# EAGLE schematic ptn_eagle7x (EAGLE 7.7.0)
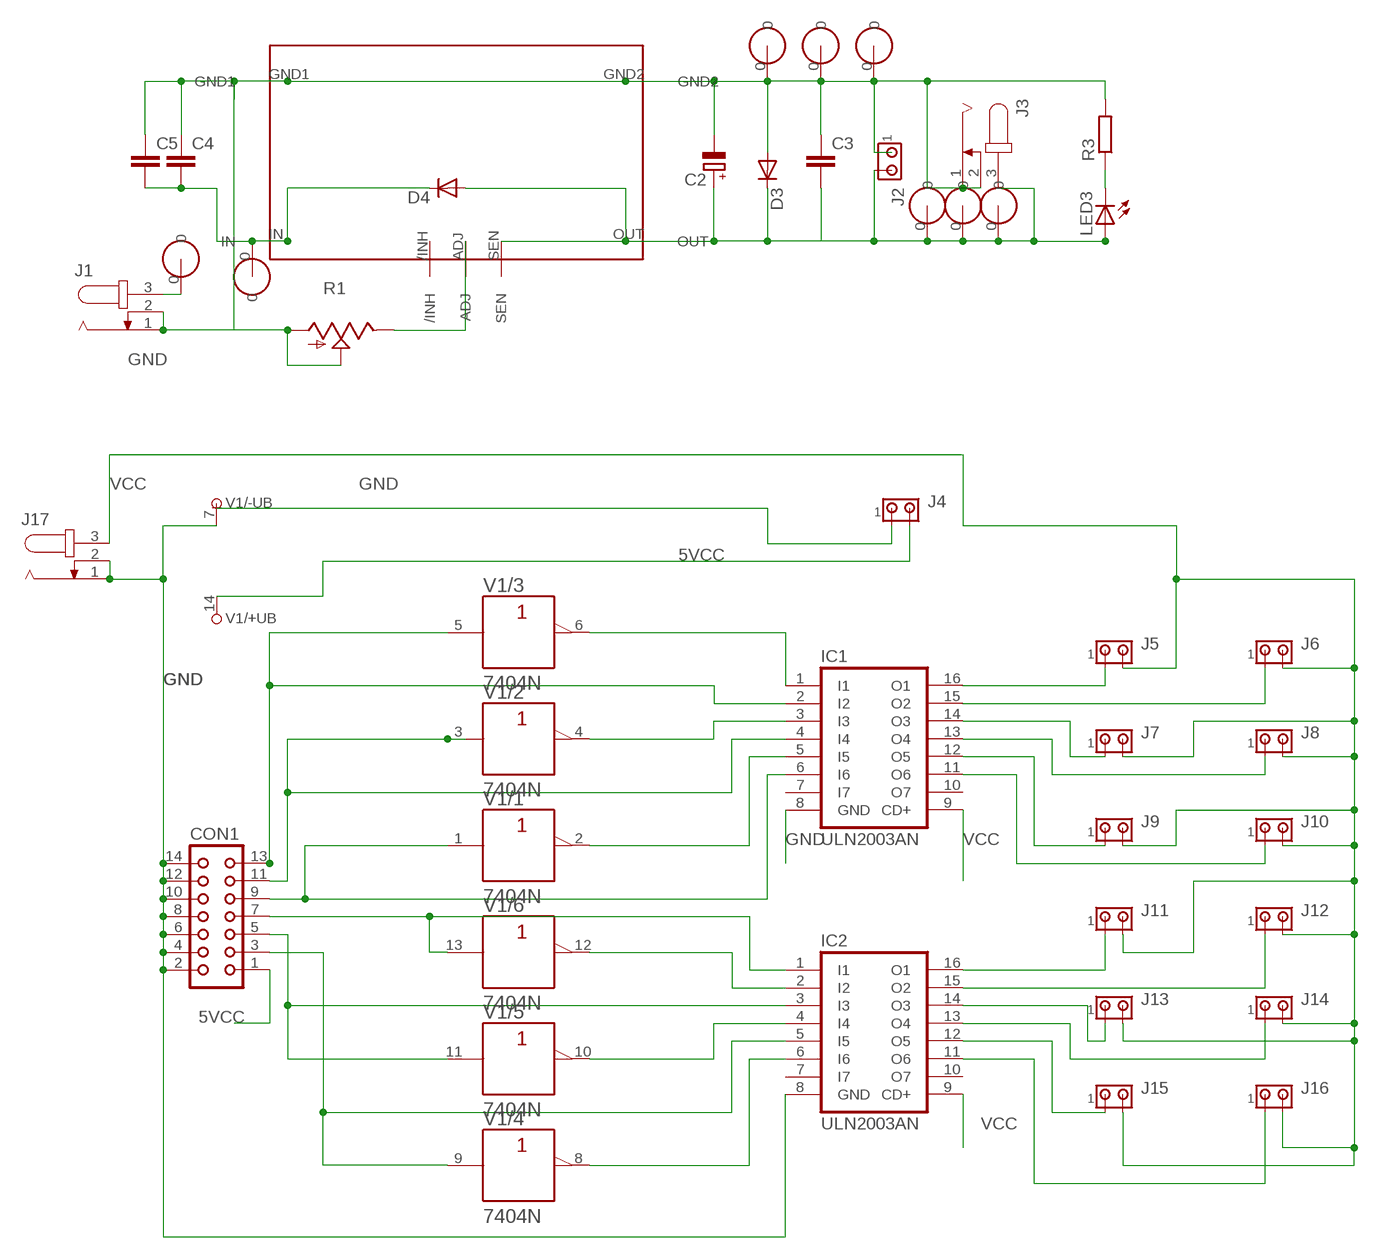
[diagram p0: schematic, sheet 1]

## Parts
C2  CPOL-EUE3.5-8  [E3,5-8]
C3  C-EUC1206K  [C1206K]
C4  C-EUC1206K  [C1206K]
C5  C-EUC1206K  [C1206K]
CON1  CON14  [CON14]
D3  DIODE-SMB  [SMB]
D4  DIODE-SMB  [SMB]
IC1  ULN2003AN  [DIL16]
IC2  ULN2003AN  [DIL16]
J1  JACK-PLUG1  [SPC4078]
J2  MTA02-100  [10X02MTA]
J3  JACK-PLUG1  [SPC4078]
J4  MTA02-100  [10X02MTA]
J5  MTA02-100  [10X02MTA]
J6  MTA02-100  [10X02MTA]
J7  MTA02-100  [10X02MTA]
J8  MTA02-100  [10X02MTA]
J9  MTA02-100  [10X02MTA]
J10  MTA02-100  [10X02MTA]
J11  MTA02-100  [10X02MTA]
J12  MTA02-100  [10X02MTA]
J13  MTA02-100  [10X02MTA]
J14  MTA02-100  [10X02MTA]
J15  MTA02-100  [10X02MTA]
J16  MTA02-100  [10X02MTA]
J17  JACK-PLUG1  [SPC4078]
LED3  LED3MM  [LED3MM]
R1  TRIM_US-B64Y  [B64Y]
R3  R-EU_R0603  [R0603]
U$1  PTNPTN2  [PTN]
U$2  PAD0  [SWITCHPAD]
U$3  PADSWITCHPAD1  [SWITCHPAD]
U$4  PADSWITCHPAD1  [SWITCHPAD]
U$5  PADSWITCHPAD1  [SWITCHPAD]
U$6  PADSWITCHPAD1  [SWITCHPAD]
U$7  PADSWITCHPAD1  [SWITCHPAD]
U$8  PADSWITCHPAD1  [SWITCHPAD]
U$9  PADSWITCHPAD1  [SWITCHPAD]
V1  7404N  [DIL14]

## Nets
5VCC: CON1.1 J4.2 V1.14(/+UB:+UB)
GND: C2.- C3.1 C4.1 C5.1 CON1.2 CON1.4 CON1.6 CON1.8 CON1.10 CON1.12 CON1.14 D3.A IC1.8(GND) IC2.8(GND) J1.1 J1.2 J2.1 J3.1 J3.2 J4.1 J17.1 J17.2 R1.A R1.S R3.2 U$1.GND1 U$1.GND2 U$4.0 U$6.0 U$8.0 V1.7(/-UB:-UB)
N$2: C4.2 C5.2 D4.C U$1.IN U$2.0
N$3: CON1.13 IC1.2(I2) V1.5(/3:A)
N$4: LED3.K(C) R3.1
N$5: R1.E U$1.ADJ
N$6: CON1.11 IC1.4(I4) V1.3(/2:A)
N$7: J1.3 U$3.0
N$8: CON1.9 IC1.6(I6) V1.1(/1:A)
N$9: C2.+ C3.2 D3.C D4.A J2.2 J3.3 LED3.A U$1.OUT U$1.SEN U$5.0 U$7.0 U$9.0
N$10: CON1.7 IC2.1(I1) V1.13(/6:A)
N$11: CON1.5 IC2.3(I3) V1.11(/5:A)
N$12: CON1.3 IC2.5(I5) V1.9(/4:A)
N$13: IC1.1(I1) V1.6(/3:Y)
N$14: IC2.2(I2) V1.12(/6:Y)
N$15: IC2.4(I4) V1.10(/5:Y)
N$16: IC2.6(I6) V1.8(/4:Y)
N$17: IC1.16(O1) J5.1
N$18: IC1.15(O2) J6.1
N$19: IC1.14(O3) J7.1
N$20: IC1.13(O4) J8.1
N$21: IC1.12(O5) J9.1
N$22: IC1.11(O6) J10.1
N$23: IC2.16(O1) J11.1
N$24: IC2.15(O2) J12.1
N$25: IC2.14(O3) J13.1
N$26: IC2.13(O4) J14.1
N$27: IC2.12(O5) J15.1
N$28: IC2.11(O6) J16.1
N$29: IC1.3(I3) V1.4(/2:Y)
N$30: IC1.5(I5) V1.2(/1:Y)
VCC: IC1.9(CD+) IC2.9(CD+) J5.2 J6.2 J7.2 J8.2 J9.2 J10.2 J11.2 J12.2 J13.2 J14.2 J15.2 J16.2 J17.3
Unconnected: IC1.7(I7) IC1.10(O7) IC2.7(I7) IC2.10(O7) U$1./INH

## Library data of the parts
C2 = rcl:CPOL-EU: POLARIZED CAPACITOR, European symbol
C3-C5 = rcl:C-EU: CAPACITOR, European symbol
CON1 = con-harting:CON14: CONNECTOR
D3 D4 = diode:DIODE-: DIODE
IC1 IC2 = uln-udn:ULN2003A: DRIVER ARRAY
J1 J3 J17 = con-jack:JACK-PLUG: DC POWER JACK Power Jack, DC, Right Angle, Through Hole, Rated 5A at 16VDC, PC Terminals Distributor: Farnell (www.Farnell.de) Drawing: 84N1161.pdf / 84N1162.pdf Manufacturer: SPC Technology (www.spctechnology.com) Type: SPC4077 / SPC 4078
J2 J4-J16 = con-amp:MTA02-100: AMP connector
LED3 = led:LED: LED OSRAM: - CHIPLED LG R971, LG N971, LY N971, LG Q971, LY Q971, LO R971, LY R971 LH N974, LH R974 LS Q976, LO Q976, LY Q976 LO Q996 - Hyper CHIPLED LW Q18S LB Q993, LB Q99A, LB R99A - SideLED LS A670, LO A670, LY A670, LG A670, LP A670 LB A673, LV A673, LT A673, LW A673 LH A674 LY A675 LS A676, LA A676, LO A676, LY A676, LW A676 LS A679, LY A679, LG A679 - Hyper Micro SIDELED® LS Y876, LA Y876, LO Y876, LY Y876 LT Y87S - SmartLED LW L88C, LW L88S LB L89C, LB L89S, LG L890 LS L89K, LO L89K, LY L89K LS L896, LA L896, LO L896, LY L896 - TOPLED LS T670, LO T670, LY T670, LG T670, LP T670 LSG T670, LSP T670, LSY T670, LOP T670, LYG T670 LG T671, LOG T671, LSG T671 LB T673, LV T673, LT T673, LW T673 LH T674 LS T676, LA T676, LO T676, LY T676, LB T676, LH T676, LSB T676, LW T676 LB T67C, LV T67C, LT T67C, LS T67K, LO T67K, LY T67K, LW E67C LS E67B, LA E67B, LO E67B, LY E67B, LB E67C, LV E67C, LT E67C LW T67C LS T679, LY T679, LG T679 LS T770, LO T770, LY T770, LG T770, LP T770 LB T773, LV T773, LT T773, LW T773 LH T774 LS E675, LA E675, LY E675, LS T675 LS T776, LA T776, LO T776, LY T776, LB T776 LHGB T686 LT T68C, LB T68C - Hyper Mini TOPLED® LB M676 - Mini TOPLED Santana® LG M470 LS M47K, LO M47K, LY M47K Source: http://www.osram.convergy.de LUXEON: - LUMILED® LXK2-PW12-R00, LXK2-PW12-S00, LXK2-PW14-U00, LXK2-PW14-V00 LXK2-PM12-R00, LXK2-PM12-S00, LXK2-PM14-U00 LXK2-PE12-Q00, LXK2-PE12-R00, LXK2-PE12-S00, LXK2-PE14-T00, LXK2-PE14-U00 LXK2-PB12-K00, LXK2-PB12-L00, LXK2-PB12-M00, LXK2-PB14-N00, LXK2-PB14-P00, LXK2-PB14-Q00 LXK2-PR12-L00, LXK2-PR12-M00, LXK2-PR14-Q00, LXK2-PR14-R00 LXK2-PD12-Q00, LXK2-PD12-R00, LXK2-PD12-S00 LXK2-PH12-R00, LXK2-PH12-S00 LXK2-PL12-P00, LXK2-PL12-Q00, LXK2-PL12-R00 Source: www.luxeon.com KINGBRIGHT: KA-3528ASYC Source: www.kingbright.com
R1 = pot:TRIM_US-: POTENTIOMETER
R3 = rcl:R-EU_: RESISTOR, European symbol
U$1 = ptn78020_2:PTN
U$2-U$9 = switchpad:PAD
V1 = 74ttl-din:74*04: Hex INVERTER